# EAGLE design a4988-driver-arduino-shield-v1 (EAGLE 9.2.0)
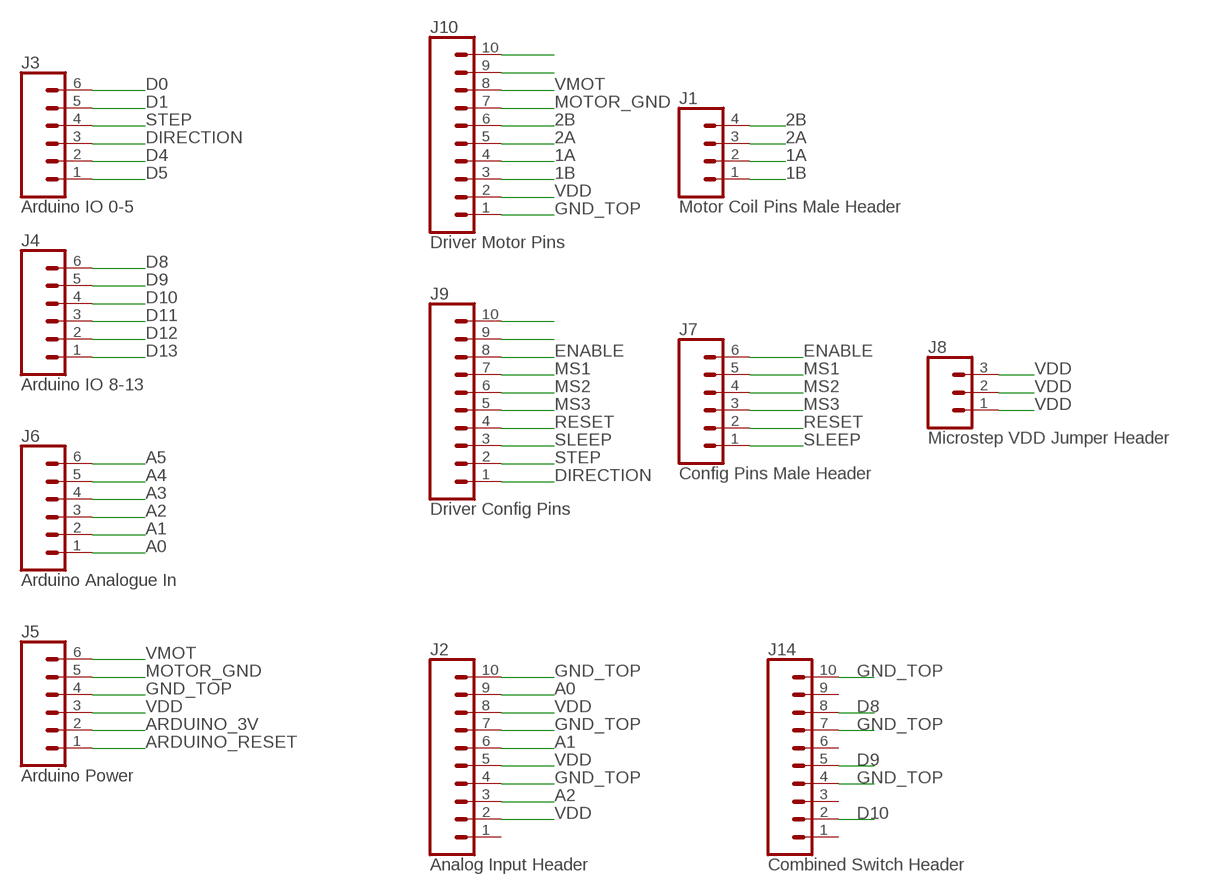
[diagram p0: schematic, sheet 1]

## Parts
J1  Motor Coil Pins Male Header  CONN_04LONGPADS  [1X04_LONGPADS]
J2  Analog Input Header  CONN_10SMD_MALE  [1X10_SMD_MALE]
J3  Arduino IO 0-5  CONN_06NO_SILK_FEMALE_PTH  [1X06_NO_SILK]
J4  Arduino IO 8-13  CONN_06NO_SILK_FEMALE_PTH  [1X06_NO_SILK]
J5  Arduino Power  CONN_06NO_SILK_FEMALE_PTH  [1X06_NO_SILK]
J6  Arduino Analogue In  CONN_06NO_SILK_FEMALE_PTH  [1X06_NO_SILK]
J7  Config Pins Male Header  CONN_06SMD_MALE  [1X06_SMD_MALE]
J8  Microstep VDD Jumper Header  CONN_03LONGPADS  [1X03_LONGPADS]
J9  Driver Config Pins  CONN_10SMD_MALE  [1X10_SMD_MALE]
J10  Driver Motor Pins  CONN_10SMD_MALE  [1X10_SMD_MALE]
J14  Combined Switch Header  CONN_10SMD_MALE  [1X10_SMD_MALE]

## Nets
1A: J1.2 J10.4
1B: J1.1 J10.3
2A: J1.3 J10.5
2B: J1.4 J10.6
A0: J2.9 J6.1
A1: J2.6 J6.2
A2: J2.3 J6.3
A3: J6.4
A4: J6.5
A5: J6.6
ARDUINO_3V: J5.2
ARDUINO_RESET: J5.1
D0: J3.6
D1: J3.5
D4: J3.2
D5: J3.1
D8: J4.6 J14.8
D9: J4.5 J14.5
D10: J4.4 J14.2
D11: J4.3
D12: J4.2
D13: J4.1
DIRECTION: J3.3 J9.1
ENABLE: J7.6 J9.8
GND_TOP: J2.4 J2.7 J2.10 J5.4 J10.1 J14.4 J14.7 J14.10
MOTOR_GND: J5.5 J10.7
MS1: J7.5 J9.7
MS2: J7.4 J9.6
MS3: J7.3 J9.5
N$13: J10.9
N$14: J10.10
N$23: J9.9
N$24: J9.10
RESET: J7.2 J9.4
SLEEP: J7.1 J9.3
STEP: J3.4 J9.2
VDD: J2.2 J2.5 J2.8 J5.3 J8.1 J8.2 J8.3 J10.2
VMOT: J5.6 J10.8
Unconnected: J2.1 J14.1 J14.3 J14.6 J14.9

## Library data of the parts
J1 = SparkFun-Connectors:CONN_04: Multi connection point. Often used as Generic Header-pin footprint for 0.1 inch spaced/style header connections On any of the 0.1 inch spaced packages, you can populate with these: Break Away Headers - Straight <https://www.sparkfun.com/products/116> (PRT-00116) Break Away Male Headers - Right Angle <https://www.sparkfun.com/products/553> (PRT-00553) Female Headers <https://www.sparkfun.com/products/115> (PRT-00115) Break Away Headers - Machine Pin <https://www.sparkfun.com/products/117> (PRT-00117) Break Away Female Headers - Swiss Machine Pin <https://www.sparkfun.com/products/743> (PRT-00743) For SCREWTERMINALS and SPRING TERMINALS visit here: Screw Terimnals on SparkFun.com <https://www.sparkfun.com/search/results?term=Screw+Terminals> (5mm/3.5mm/2.54mm spacing) This device is also useful as a general connection point to wire up your design to another part of your project. Our various solder wires solder well into these plated through hole pads. Hook-Up Wire - Assortment (Stranded, 22 AWG) <https://www.sparkfun.com/products/11375> (PRT-11375) Hook-Up Wire - Assortment (Solid Core, 22 AWG) <https://www.sparkfun.com/products/11367> (PRT-11367) View the entire wire category on our website here <https://www.sparkfun.com/categories/141> Special notes: Molex polarized connector foot print use with SKU : PRT-08231 with associated crimp pins and housings. 1MM SMD Version SKU: PRT-10208; PROD_ID: CONN-09696
J2 J9 J10 J14 = SparkFun-Connectors:CONN_10: Multi connection point. Often used as Generic Header-pin footprint for 0.1 inch spaced/style header connections On any of the 0.1 inch spaced packages, you can populate with these: Break Away Headers - Straight <https://www.sparkfun.com/products/116> (PRT-00116) Break Away Male Headers - Right Angle <https://www.sparkfun.com/products/553> (PRT-00553) Female Headers <https://www.sparkfun.com/products/115> (PRT-00115) Break Away Headers - Machine Pin <https://www.sparkfun.com/products/117> (PRT-00117) Break Away Female Headers - Swiss Machine Pin <https://www.sparkfun.com/products/743> (PRT-00743) Arduino Stackable Header - 10 Pin <https://www.sparkfun.com/products/11376> (PRT-11376) For SCREWTERMINALS and SPRING TERMINALS visit here: Screw Terimnals on SparkFun.com <https://www.sparkfun.com/search/results?term=Screw+Terminals> (5mm/3.5mm/2.54mm spacing) This device is also useful as a general connection point to wire up your design to another part of your project. Our various solder wires solder well into these plated through hole pads. Hook-Up Wire - Assortment (Stranded, 22 AWG) <https://www.sparkfun.com/products/11375> (PRT-11375) Hook-Up Wire - Assortment (Solid Core, 22 AWG) <https://www.sparkfun.com/products/11367> (PRT-11367) View the entire wire category on our website here <https://www.sparkfun.com/categories/141> Special notes: Molex polarized connector foot print use with SKU : PRT-08231 with associated crimp pins and housings. 1MM SMD Version SKU: PRT-10208 NOTES ON THE VARIANTS LOCK and LOCK_LONGPADS... This footprint was designed to help hold the alignment of a through-hole component (i.e. 6-pin header) while soldering it into place. You may notice that each hole has been shifted either up or down by 0.005 of an inch from it's more standard position (which is a perfectly straight line). This slight alteration caused the pins (the squares in the middle) to touch the edges of the holes. Because they are alternating, it causes a "brace" to hold the component in place. 0.005 has proven to be the perfect amount of "off-center" position when using our standard breakaway headers. Although looks a little odd when you look at the bare footprint, once you have a header in there, the alteration is very hard to notice. Also,if you push a header all the way into place, it is covered up entirely on the bottom side.; PROD_ID: CONN-11291
J3-J6 = SparkFun-Connectors:CONN_06: Multi connection point. Often used as Generic Header-pin footprint for 0.1 inch spaced/style header connections On any of the 0.1 inch spaced packages, you can populate with these: Break Away Headers - Straight <https://www.sparkfun.com/products/116> (PRT-00116) Break Away Male Headers - Right Angle <https://www.sparkfun.com/products/553> (PRT-00553) Female Headers <https://www.sparkfun.com/products/115> (PRT-00115) Break Away Headers - Machine Pin <https://www.sparkfun.com/products/117> (PRT-00117) Break Away Female Headers - Swiss Machine Pin <https://www.sparkfun.com/products/743> (PRT-00743) Arduino Stackable Header - 6 Pin <https://www.sparkfun.com/products/9280> (PRT-09280) For SCREWTERMINALS and SPRING TERMINALS visit here: Screw Terimnals on SparkFun.com <https://www.sparkfun.com/search/results?term=Screw+Terminals> (5mm/3.5mm/2.54mm spacing) This device is also useful as a general connection point to wire up your design to another part of your project. Our various solder wires solder well into these plated through hole pads. Hook-Up Wire - Assortment (Stranded, 22 AWG) <https://www.sparkfun.com/products/11375> (PRT-11375) Hook-Up Wire - Assortment (Solid Core, 22 AWG) <https://www.sparkfun.com/products/11367> (PRT-11367) View the entire wire category on our website here <https://www.sparkfun.com/categories/141>; PROD_ID: CONN-08437
J7 = SparkFun-Connectors:CONN_06: Multi connection point. Often used as Generic Header-pin footprint for 0.1 inch spaced/style header connections On any of the 0.1 inch spaced packages, you can populate with these: Break Away Headers - Straight <https://www.sparkfun.com/products/116> (PRT-00116) Break Away Male Headers - Right Angle <https://www.sparkfun.com/products/553> (PRT-00553) Female Headers <https://www.sparkfun.com/products/115> (PRT-00115) Break Away Headers - Machine Pin <https://www.sparkfun.com/products/117> (PRT-00117) Break Away Female Headers - Swiss Machine Pin <https://www.sparkfun.com/products/743> (PRT-00743) Arduino Stackable Header - 6 Pin <https://www.sparkfun.com/products/9280> (PRT-09280) For SCREWTERMINALS and SPRING TERMINALS visit here: Screw Terimnals on SparkFun.com <https://www.sparkfun.com/search/results?term=Screw+Terminals> (5mm/3.5mm/2.54mm spacing) This device is also useful as a general connection point to wire up your design to another part of your project. Our various solder wires solder well into these plated through hole pads. Hook-Up Wire - Assortment (Stranded, 22 AWG) <https://www.sparkfun.com/products/11375> (PRT-11375) Hook-Up Wire - Assortment (Solid Core, 22 AWG) <https://www.sparkfun.com/products/11367> (PRT-11367) View the entire wire category on our website here <https://www.sparkfun.com/categories/141>; PROD_ID: CONN-11293
J8 = SparkFun-Connectors:CONN_03: Multi connection point. Often used as Generic Header-pin footprint for 0.1 inch spaced/style header connections On any of the 0.1 inch spaced packages, you can populate with these: Break Away Headers - Straight <https://www.sparkfun.com/products/116> (PRT-00116) Break Away Male Headers - Right Angle <https://www.sparkfun.com/products/553> (PRT-00553) Female Headers <https://www.sparkfun.com/products/115> (PRT-00115) Break Away Headers - Machine Pin <https://www.sparkfun.com/products/117> (PRT-00117) Break Away Female Headers - Swiss Machine Pin <https://www.sparkfun.com/products/743> (PRT-00743) Stackable Header - 3 Pin (Female, 0.1") <https://www.sparkfun.com/products/13875> (PRT-13875) For SCREWTERMINALS and SPRING TERMINALS visit here: Screw Terimnals on SparkFun.com <https://www.sparkfun.com/search/results?term=Screw+Terminals> (5mm/3.5mm/2.54mm spacing) This device is also useful as a general connection point to wire up your design to another part of your project. Our various solder wires solder well into these plated through hole pads. Hook-Up Wire - Assortment (Stranded, 22 AWG) <https://www.sparkfun.com/products/11375> (PRT-11375) Hook-Up Wire - Assortment (Solid Core, 22 AWG) <https://www.sparkfun.com/products/11367> (PRT-11367) View the entire wire category on our website here <https://www.sparkfun.com/categories/141> Special notes: Molex polarized connector foot print use with SKU : PRT-08232 with associated crimp pins and housings.

## Board
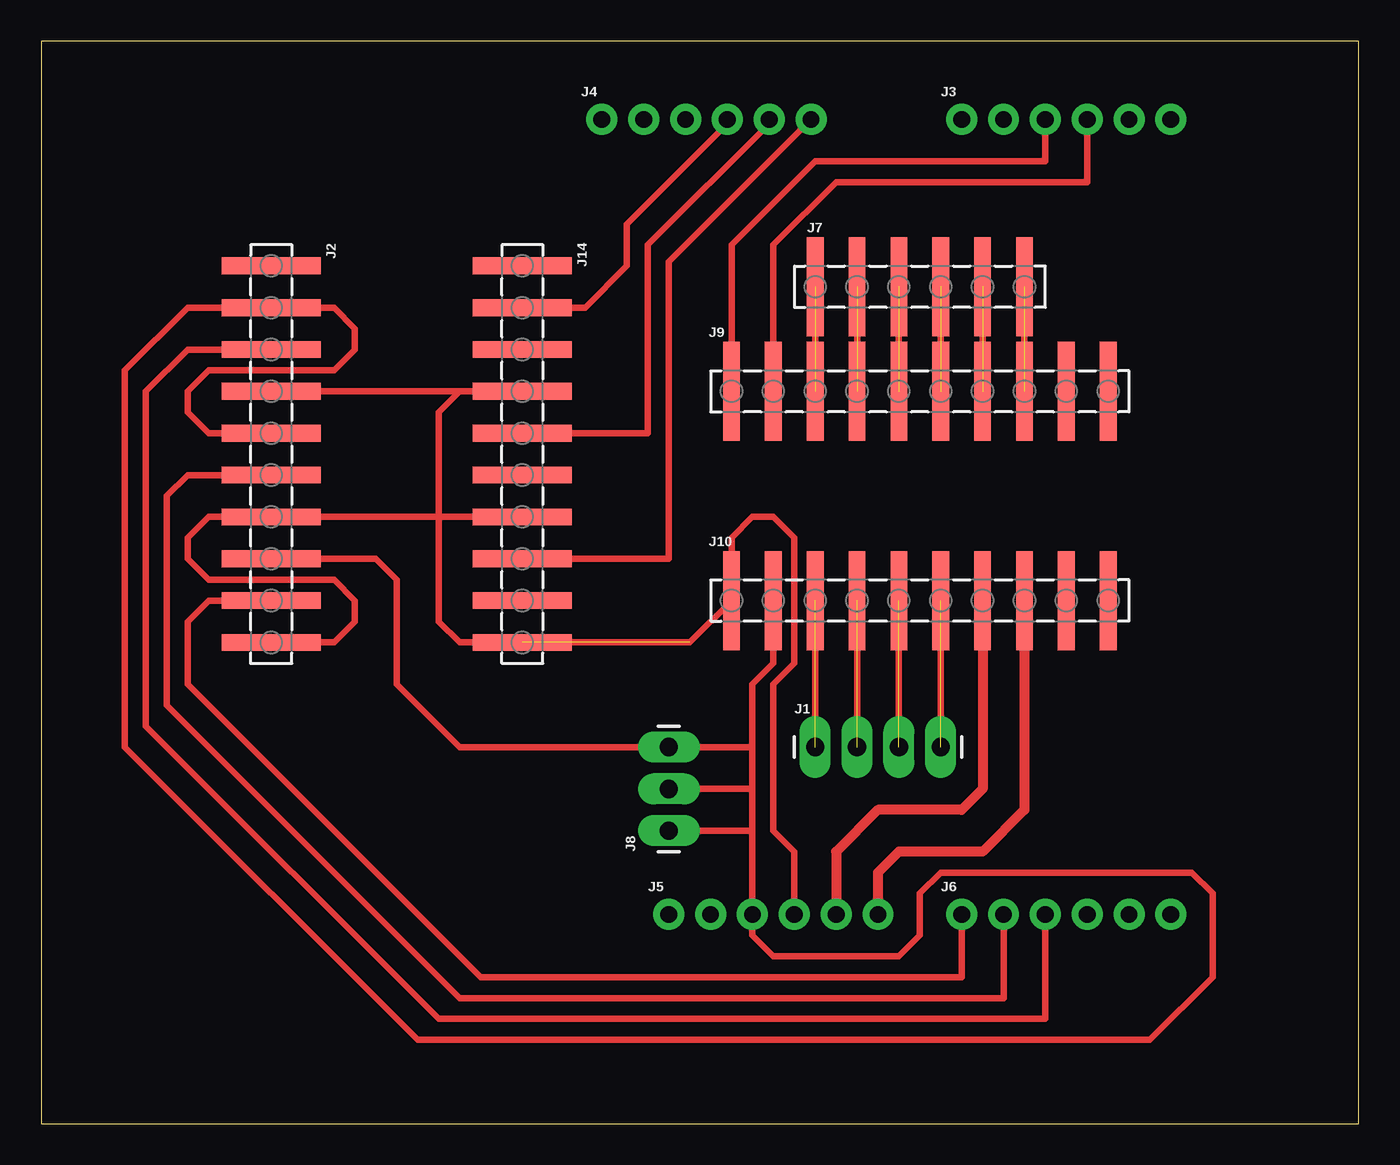
[diagram p1: board, top side]

Size 79.99 x 65.71 mm. Coordinates in mm from the lower left corner, seen from the top.
Outline: 0,0 79.99,0 79.99,65.71 0,65.71 0,0
Copper layers (1*16): Top 0.035mm / dielectric 1.5mm / Bottom 0.035mm
Design rules "default": minimum track width 6mil, minimum drill 0.35mm, track to track 6mil, track to pad 6mil, pad to pad 6mil, via to via 6mil, smd to smd 6mil, copper to edge 40mil, drill to drill 6mil, minimum pad ring 10mil, minimum via ring 8mil, stop-mask expansion 4mil, vias tented up to drill 0mil, thermal gap 10mil

### Footprints (pad centres in the part's own frame; a part is rotated, then mirrored left to right if it is on the bottom)
1X04_LONGPADS = drill 1.118 pad 1.88 long: 1 0,0; 2 2.54,0; 3 5.08,0; 4 7.62,0
1X10_SMD_MALE = smd 1.02 x 6: 1 0,0; 2 2.54,0; 3 5.08,0; 4 7.62,0; 5 10.16,0; 6 12.7,0; 7 15.24,0; 8 17.78,0; 9 20.32,0; 10 22.86,0
1X06_NO_SILK = drill 1.016 pad 1.88: 1 0,0; 2 2.54,0; 3 5.08,0; 4 7.62,0; 5 10.16,0; 6 12.7,0
1X06_SMD_MALE = smd 1.02 x 6: 1 0,0; 2 2.54,0; 3 5.08,0; 4 7.62,0; 5 10.16,0; 6 12.7,0
1X03_LONGPADS = drill 1.118 pad 1.88 long: 1 0,0; 2 2.54,0; 3 5.08,0

### Placement (x,y rotation side)
J1  46.99,22.86 0 top
J2  13.97,52.07 270 top
J3  55.88,60.96 0 top
J4  34.04,60.96 0 top
J5  38.1,12.7 0 top
J6  55.88,12.7 0 top
J7  46.99,50.8 0 top
J8  38.1,17.78 90 top
J9  41.91,44.45 0 top
J10  41.91,31.75 0 top
J14  29.21,52.07 270 top

### Tracks (layer width: path | path; a pad name or v marks a point on that pad's centre or on a via)
1A  (2 unrouted)
  Top 0.406: J10.4 J1.2
1B  (2 unrouted)
  Top 0.406: J10.3 J1.1
2A  (2 unrouted)
  Top 0.406: J10.5 J1.3
2B  (2 unrouted)
  Top 0.406: J10.6 J1.4
A0
  Top 0.406: J6.1 55.88,8.89 26.67,8.89 8.89,26.67 8.89,30.48 10.16,31.75 J2.9
A1
  Top 0.406: J2.6 8.89,39.37 7.62,38.1 7.62,25.4 25.4,7.62 58.42,7.62 J6.2
A2
  Top 0.406: J2.3 8.89,46.99 6.35,44.45 6.35,24.13 24.13,6.35 60.96,6.35 J6.3
D8
  Top 0.406: J14.8 38.1,34.29 38.1,52.32 J4.6
D9
  Top 0.406: J14.5 36.83,41.91 36.83,53.34 44.2,60.71 J4.5
D10
  Top 0.406: J14.2 33.02,49.53 35.56,52.07 35.56,54.61 41.66,60.71 J4.4
DIRECTION
  Top 0.406: J9.1 41.91,53.34 46.99,58.42 60.96,58.42 J3.3
ENABLE  (1 unrouted)
  Top 0.406: J7.6 J9.8
GND_TOP  (1 unrouted)
  Top 0.406: 24.13,36.83 24.13,43.18 25.4,44.45 | J14.4 25.4,44.45 | J14.7 24.13,36.83 | 24.13,36.83 24.13,30.48 25.4,29.21 J14.10 39.37,29.21 J10.1 41.91,35.56 43.18,36.83 44.45,36.83 45.72,35.56 45.72,27.94 44.45,26.67 44.45,17.78 45.72,16.51 J5.4 | 24.13,36.83 J2.7 10.16,36.83 8.89,35.56 8.89,34.29 10.16,33.02 17.78,33.02 19.05,31.75 19.05,30.48 17.78,29.21 J2.10 | 25.4,44.45 J2.4
MOTOR_GND
  Top 0.61: J5.5 48.26,16.51 50.8,19.05 55.88,19.05 57.15,20.32 J10.7
MS1  (1 unrouted)
  Top 0.406: J7.5 J9.7
MS2  (1 unrouted)
  Top 0.406: J7.4 J9.6
MS3  (1 unrouted)
  Top 0.406: J7.3 J9.5
RESET  (1 unrouted)
  Top 0.406: J7.2 J9.4
SLEEP  (1 unrouted)
  Top 0.406: J7.1 J9.3
STEP
  Top 0.406: J9.2 44.45,53.34 48.26,57.15 63.5,57.15 J3.4
VDD
  Top 0.406: J10.2 44.45,27.94 43.18,26.67 43.18,22.86 | 43.18,22.86 43.18,20.32 | 43.18,20.32 43.18,17.78 | 43.18,17.78 J5.3 43.18,11.43 44.45,10.16 52.07,10.16 53.34,11.43 53.34,13.97 54.61,15.24 69.85,15.24 71.12,13.97 71.12,8.89 67.31,5.08 22.86,5.08 5.08,22.86 5.08,45.72 8.89,49.53 J2.2 17.78,49.53 19.05,48.26 19.05,46.99 17.78,45.72 10.16,45.72 8.89,44.45 8.89,43.18 10.16,41.91 J2.5 | 43.18,17.78 J8.1 | 43.18,20.32 J8.2 | 43.18,22.86 J8.3 25.4,22.86 21.59,26.67 21.59,33.02 20.32,34.29 J2.8
VMOT
  Top 0.61: J10.8 59.69,19.05 57.15,16.51 52.07,16.51 50.8,15.24 J5.6